# Altium schematic sheet T100CurrentMonitor.SchDoc
size A
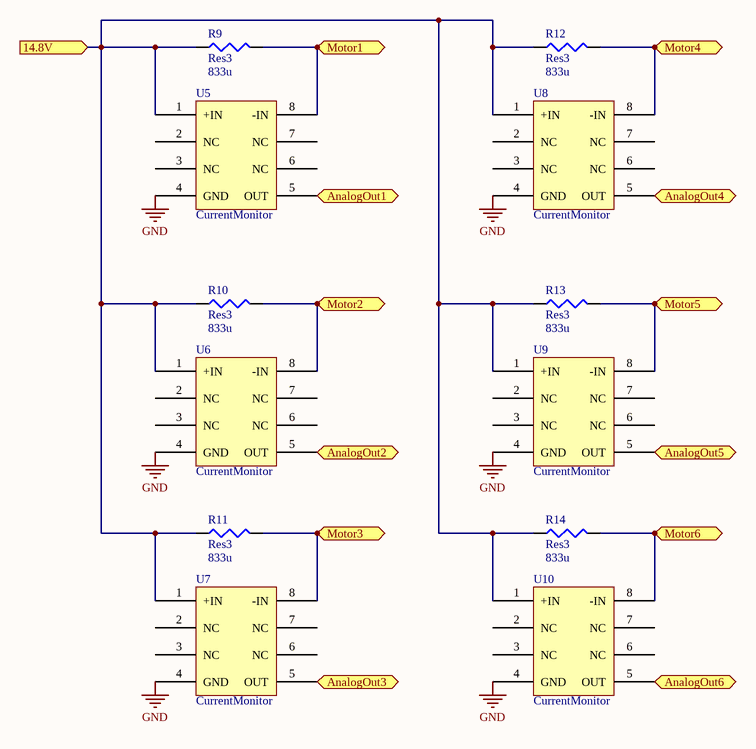
[diagram p0: T100CurrentMonitor.SchDoc]

## Parts
R9  Res3  value 833u  [Resistor075mohms]
R10  Res3  value 833u  [Resistor075mohms]
R11  Res3  value 833u  [Resistor075mohms]
R12  Res3  value 833u  [Resistor075mohms]
R13  Res3  value 833u  [Resistor075mohms]
R14  Res3  value 833u  [Resistor075mohms]
U5  CurrentMonitor  [AD8217]
U6  CurrentMonitor  [AD8217]
U7  CurrentMonitor  [AD8217]
U8  CurrentMonitor  [AD8217]
U9  CurrentMonitor  [AD8217]
U10  CurrentMonitor  [AD8217]

## Ports
14.8V (in), AnalogOut1 (out), AnalogOut2 (out), AnalogOut3 (out), AnalogOut4 (out), AnalogOut5 (out), AnalogOut6 (out), Motor1 (out), Motor2 (out), Motor3 (out), Motor4 (out), Motor5 (out), Motor6 (out)

## Nets
GND: U5.4(GND) U6.4(GND) U7.4(GND) U8.4(GND) U9.4(GND) U10.4(GND)
14.8V: R9.1 R10.1 R11.1 R12.1 R13.1 R14.1 U5.1(+IN) U6.1(+IN) U7.1(+IN) U8.1(+IN) U9.1(+IN) U10.1(+IN) ; port 14.8V
AnalogOut1: U5.5(OUT) ; port AnalogOut1
AnalogOut2: U6.5(OUT) ; port AnalogOut2
AnalogOut3: U7.5(OUT) ; port AnalogOut3
AnalogOut4: U8.5(OUT) ; port AnalogOut4
AnalogOut5: U9.5(OUT) ; port AnalogOut5
AnalogOut6: U10.5(OUT) ; port AnalogOut6
Motor1: R9.2 U5.8(-IN) ; port Motor1
Motor2: R10.2 U6.8(-IN) ; port Motor2
Motor3: R11.2 U7.8(-IN) ; port Motor3
Motor4: R12.2 U8.8(-IN) ; port Motor4
Motor5: R13.2 U9.8(-IN) ; port Motor5
Motor6: R14.2 U10.8(-IN) ; port Motor6

Not connected (* = marked no-connect by the designer): U5 2(NC) 3(NC) 6(NC) 7(NC); U6 2(NC) 3(NC) 6(NC) 7(NC); U7 2(NC) 3(NC) 6(NC) 7(NC); U8 2(NC) 3(NC) 6(NC) 7(NC); U9 2(NC) 3(NC) 6(NC) 7(NC); U10 2(NC) 3(NC) 6(NC) 7(NC)

## Library data of the parts
R9-R14 = Res3: Resistor; Published: 8-Jun-2000; LatestRevisionDate: 29-May-2009; LatestRevisionNote: IPC-7351 Footprint Added.; PackageReference: J1-0603; Publisher: Altium Limited; PackageDescription: Chip Resistor
U5-U10 = AD8217